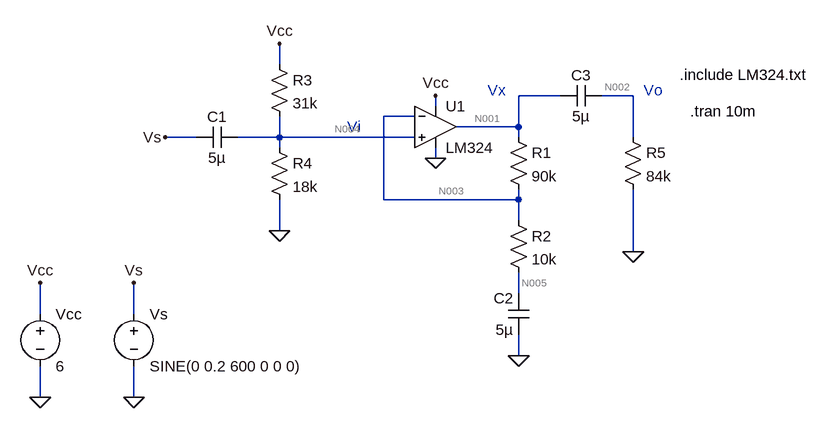
[diagram p0: schematic task1.asc]
task1.asc, the LTspice schematic file:
Version 4.1
SHEET 1 880 680
WIRE -256 32 -256 0
WIRE 176 80 112 80
WIRE 288 80 240 80
WIRE -16 96 -16 80
WIRE -48 112 -96 112
WIRE 112 128 112 80
WIRE 112 128 16 128
WIRE -384 144 -432 144
WIRE -256 144 -256 112
WIRE -256 144 -320 144
WIRE -48 144 -256 144
WIRE 112 144 112 128
WIRE 288 144 288 80
WIRE -256 160 -256 144
WIRE -16 176 -16 160
WIRE -96 240 -96 112
WIRE 112 240 112 224
WIRE 112 240 -96 240
WIRE 112 272 112 240
WIRE -256 288 -256 240
WIRE 288 320 288 224
WIRE 112 384 112 352
WIRE -624 416 -624 368
WIRE -480 416 -480 368
WIRE 112 480 112 448
WIRE -624 544 -624 496
WIRE -480 544 -480 496
FLAG 288 320 0
FLAG 112 480 0
FLAG -256 288 0
FLAG -432 144 Vs
FLAG -256 0 Vcc
FLAG -480 544 0
FLAG -624 544 0
FLAG -480 368 Vs
FLAG -624 368 Vcc
FLAG -16 176 0
FLAG -16 80 Vcc
SYMBOL res 96 128 R0
SYMATTR InstName R1
SYMATTR Value 90k
SYMBOL res 96 256 R0
SYMATTR InstName R2
SYMATTR Value 10k
SYMBOL res -272 16 R0
SYMATTR InstName R3
SYMATTR Value 31k
SYMBOL res -272 144 R0
SYMATTR InstName R4
SYMATTR Value 18k
SYMBOL res 272 128 R0
SYMATTR InstName R5
SYMATTR Value 84k
SYMBOL cap -320 128 R90
WINDOW 0 0 32 VBottom 2
WINDOW 3 32 32 VTop 2
SYMATTR InstName C1
SYMATTR Value 5µ
SYMBOL cap 128 448 R180
WINDOW 0 24 56 Left 2
WINDOW 3 24 8 Left 2
SYMATTR InstName C2
SYMATTR Value 5µ
SYMBOL cap 176 96 R270
WINDOW 0 32 32 VTop 2
WINDOW 3 0 32 VBottom 2
SYMATTR InstName C3
SYMATTR Value 5µ
SYMBOL OpAmps\\opamp2 -16 64 R0
SYMATTR InstName U1
SYMATTR Value LM324
SYMBOL voltage -480 400 R0
WINDOW 123 0 0 Left 0
WINDOW 39 0 0 Left 0
SYMATTR InstName Vs
SYMATTR Value SINE(0 0.2 600 0 0 0)
SYMBOL voltage -624 400 R0
WINDOW 123 0 0 Left 0
WINDOW 39 0 0 Left 0
SYMATTR InstName Vcc
SYMATTR Value 6
TEXT 360 48 Left 2 !.include LM324.txt
TEXT 304 72 Left 2 ;Vo
TEXT 64 72 Left 2 ;Vx
TEXT -152 128 Left 2 ;Vi
TEXT 376 104 Left 2 !.tran 10m

The netlist it stands for:
* task1.asc
R1 N001 N003 90k
R2 N003 N005 10k
R3 Vcc N004 31k
R4 N004 0 18k
R5 N002 0 84k
C1 N004 Vs 5µ
C2 0 N005 5µ
C3 N001 N002 5µ
X§U1 N004 N003 Vcc 0 N001 LM324  ; pins In+ In- V+ V- OUT
Vs Vs 0 SINE(0 0.2 600 0 0 0)
Vcc Vcc 0 6
.include LM324.txt
* Vo
* Vx
* Vi
.tran 10m
.backanno
.end

* Results of the author's LTspice run, read from the files saved beside the schematic
* Operating Point, zero values left out:
*   V(n001) = 2.203 V
*   V(n003) = 2.204 V
*   V(n004) = 2.204 V
*   V(n005) = 2.204 V
*   V(vcc) = 6 V
*   I(R1) = -20.01 nA
*   I(R3) = 122.4 µA
*   I(R4) = 122.5 µA
*   I(Vcc) = -330.4 µA
*   Ix(u1:1) = -20.02 nA
*   Ix(u1:2) = -20.01 nA
*   Ix(u1:3) = 208 µA
*   Ix(u1:4) = -208 µA
*   Ix(u1:5) = 20.01 nA
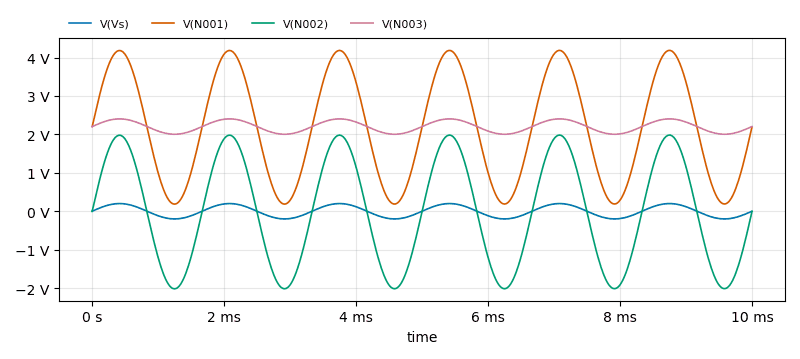
[diagram p1: Transient Analysis of task1.asc, plotted from the saved traces]
* Transient Analysis, 1 run:
*   V(Vs): min -200 mV, max 200 mV, average -36.53 µV, rms 141.5 mV, last 0 V
*   V(N001): min 185.4 mV, max 4.186 V, average 2.186 V, rms 2.603 V, last 2.195 V
*   V(N002): min -2.018 V, max 1.983 V, average -17.83 mV, rms 1.414 V, last -6.998 mV
*   V(N003): min 2.004 V, max 2.403 V, average 2.203 V, rms 2.208 V, last 2.203 V